# EAGLE design chipchestra-v05 (EAGLE 8.0.1)
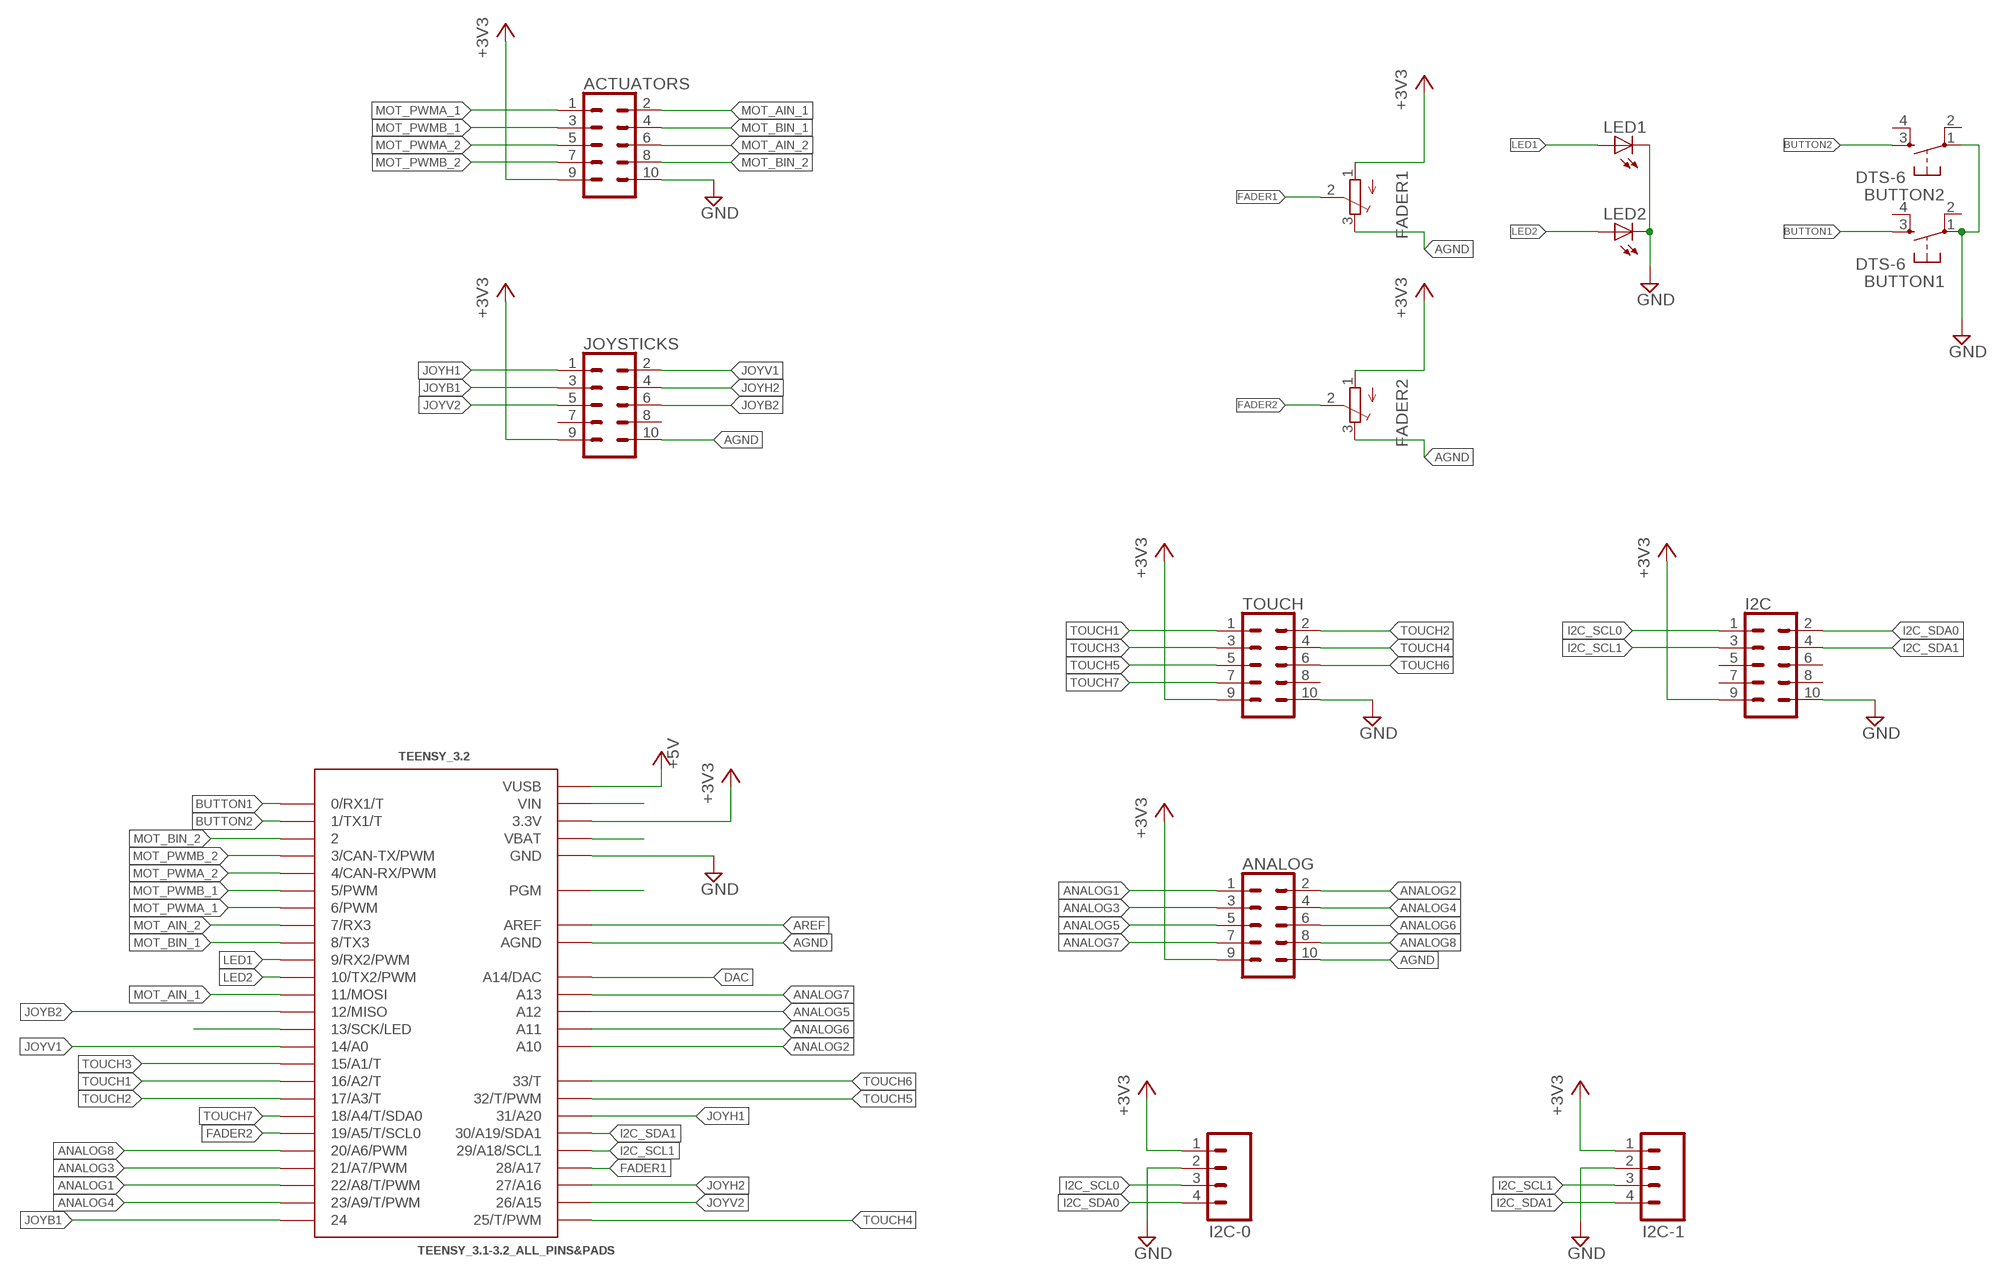
[diagram p0: schematic, sheet 1]

## Parts
ACTUATORS  CONN_05X2SHD_LOCK  [2X5-SHROUDED_LOCK]
ANALOG  CONN_05X2SHD_LOCK  [2X5-SHROUDED_LOCK]
BUTTON1  DTS-6  [DTS-6]
BUTTON2  DTS-6  [DTS-6]
FADER1  TRIMPOT3386  [TRIM-3386]
FADER2  TRIMPOT3386  [TRIM-3386]
I2C  CONN_05X2SHD_LOCK  [2X5-SHROUDED_LOCK]
I2C-0  M04LOCK  [1X04_LOCK]
I2C-1  M04LOCK  [1X04_LOCK]
JOYSTICKS  CONN_05X2SHD_LOCK  [2X5-SHROUDED_LOCK]
LED1  LED3MM  [LED3MM]
LED2  LED3MM  [LED3MM]
TEENSY_3.2  TEENSY_3.1-3.2_ALL_PINS&PADS  [TEENSY_3.0-3.2_ALL_PINS_&_PADS]
TOUCH  CONN_05X2SHD_LOCK  [2X5-SHROUDED_LOCK]

## Nets
+3V3: ACTUATORS.9 ANALOG.9 FADER1.1(A) FADER2.1(A) I2C-0.1 I2C-1.1 I2C.9 JOYSTICKS.9 TEENSY_3.2.3.3V TEENSY_3.2.3.3V1(3.3V) TEENSY_3.2.3.3V2(3.3V) TOUCH.9
+5V: TEENSY_3.2.VUSB
AGND: ANALOG.10 FADER1.3(E) FADER2.3(E) JOYSTICKS.10 TEENSY_3.2.AGND
ANALOG1: ANALOG.1 TEENSY_3.2.22/A8(22/A8/T/PWM)
ANALOG2: ANALOG.2 TEENSY_3.2.A10
ANALOG3: ANALOG.3 TEENSY_3.2.21/A7(21/A7/PWM)
ANALOG4: ANALOG.4 TEENSY_3.2.23/A9(23/A9/T/PWM)
ANALOG5: ANALOG.5 TEENSY_3.2.A12
ANALOG6: ANALOG.6 TEENSY_3.2.A11
ANALOG7: ANALOG.7 TEENSY_3.2.A13
ANALOG8: ANALOG.8 TEENSY_3.2.20/A6(20/A6/PWM)
AREF: TEENSY_3.2.AREF
BUTTON1: BUTTON1.3 TEENSY_3.2.0(0/RX1/T)
BUTTON2: BUTTON2.3 TEENSY_3.2.1(1/TX1/T)
DAC: TEENSY_3.2.RESET/DAC(A14/DAC)
FADER1: FADER1.2(S) TEENSY_3.2.28(28/A17)
FADER2: FADER2.2(S) TEENSY_3.2.19/A5(19/A5/T/SCL0)
GND: ACTUATORS.10 BUTTON1.1 BUTTON2.1 I2C-0.2 I2C-1.2 I2C.10 LED1.K(C) LED2.K(C) TEENSY_3.2.GND TEENSY_3.2.GND1(GND) TEENSY_3.2.GND2(GND) TOUCH.10
I2C_SCL0: I2C-0.3 I2C.1
I2C_SCL1: I2C-1.3 I2C.3 TEENSY_3.2.29(29/A18/SCL1)
I2C_SDA0: I2C-0.4 I2C.2
I2C_SDA1: I2C-1.4 I2C.4 TEENSY_3.2.30(30/A19/SDA1)
JOYB1: JOYSTICKS.3 TEENSY_3.2.24
JOYB2: JOYSTICKS.6 TEENSY_3.2.12(12/MISO)
JOYH1: JOYSTICKS.1 TEENSY_3.2.31(31/A20)
JOYH2: JOYSTICKS.4 TEENSY_3.2.27(27/A16)
JOYV1: JOYSTICKS.2 TEENSY_3.2.14/A0
JOYV2: JOYSTICKS.5 TEENSY_3.2.26(26/A15)
LED1: LED1.A TEENSY_3.2.9(9/RX2/PWM)
LED2: LED2.A TEENSY_3.2.10(10/TX2/PWM)
MOT_AIN_1: ACTUATORS.2 TEENSY_3.2.11(11/MOSI)
MOT_AIN_2: ACTUATORS.6 TEENSY_3.2.7(7/RX3)
MOT_BIN_1: ACTUATORS.4 TEENSY_3.2.8(8/TX3)
MOT_BIN_2: ACTUATORS.8 TEENSY_3.2.2
MOT_PWMA_1: ACTUATORS.1 TEENSY_3.2.6(6/PWM)
MOT_PWMA_2: ACTUATORS.5 TEENSY_3.2.4(4/CAN-RX/PWM)
MOT_PWMB_1: ACTUATORS.3 TEENSY_3.2.5(5/PWM)
MOT_PWMB_2: ACTUATORS.7 TEENSY_3.2.3(3/CAN-TX/PWM)
N$1: TEENSY_3.2.13(13/SCK/LED)
N$10: TEENSY_3.2.VBAT
N$48: TEENSY_3.2.VIN
N$53: TEENSY_3.2.PGM
TOUCH1: TEENSY_3.2.16/A2(16/A2/T) TOUCH.1
TOUCH2: TEENSY_3.2.17/A3(17/A3/T) TOUCH.2
TOUCH3: TEENSY_3.2.15/A1(15/A1/T) TOUCH.3
TOUCH4: TEENSY_3.2.25(25/T/PWM) TOUCH.4
TOUCH5: TEENSY_3.2.32(32/T/PWM) TOUCH.5
TOUCH6: TEENSY_3.2.33(33/T) TOUCH.6
TOUCH7: TEENSY_3.2.18/A4(18/A4/T/SDA0) TOUCH.7
Unconnected: BUTTON1.2 BUTTON1.4 BUTTON2.2 BUTTON2.4 I2C.5 I2C.6 I2C.7 I2C.8 JOYSTICKS.7 JOYSTICKS.8 TOUCH.8

## Library data of the parts
ACTUATORS ANALOG I2C JOYSTICKS TOUCH = SparkFun-Connectors:CONN_05X2: Multi connection point. Often used as Generic Header-pin footprint for 0.1 inch spaced/style header connections For AVR SPI programming port, see special device with nice symbol: "AVR_SPI_PROG_5x2.dev" You can populate with any combo of single row headers, but if you'd like an exact match, check these: 2x5 AVR ICSP Male Header <https://www.sparkfun.com/products/778> (PRT-00778) 2x5 Pin Shrouded Header <https://www.sparkfun.com/products/8506> (PRT-08506) On any of the 0.1 inch spaced packages, you can populate with these: Break Away Headers - Straight <https://www.sparkfun.com/products/116> (PRT-00116) Break Away Male Headers - Right Angle <https://www.sparkfun.com/products/553> (PRT-00553) Female Headers <https://www.sparkfun.com/products/115> (PRT-00115) Break Away Headers - Machine Pin <https://www.sparkfun.com/products/117> (PRT-00117) Break Away Female Headers - Swiss Machine Pin <https://www.sparkfun.com/products/743> (PRT-00743) Special note: the shrouded connector mates well with our 5x2 ribbon cables: 2x5 Pin IDC Ribbon Cable <https://www.sparkfun.com/products/8535> (PRT-08535); PROD_ID: CONN-08671; SF_ID: PRT-08506
BUTTON1 BUTTON2 = switch-tact:DTS-6
FADER1 FADER2 = adafruit:TRIMPOT: SMT trimmer potentiometer part number TC33X http://www.ladyada.net/library/eagle
I2C-0 I2C-1 = CMU-ArtFab:M04: Header 4 Standard 4-pin 0.1" header. Use with straight break away headers (SKU : PRT-00116), right angle break away headers (PRT-00553), swiss pins (PRT-00743), machine pins (PRT-00117), and female headers (PRT-00115). Molex polarized connector foot print use with SKU : PRT-08231 with associated crimp pins and housings. 1MM SMD Version SKU: PRT-10208
LED1 LED2 = adafruit:LED: LED OSRAM: - CHIPLED LG R971, LG N971, LY N971, LG Q971, LY Q971, LO R971, LY R971 LH N974, LH R974 LS Q976, LO Q976, LY Q976 LO Q996 - Hyper CHIPLED LW Q18S LB Q993, LB Q99A, LB R99A - SideLED LS A670, LO A670, LY A670, LG A670, LP A670 LB A673, LV A673, LT A673, LW A673 LH A674 LY A675 LS A676, LA A676, LO A676, LY A676, LW A676 LS A679, LY A679, LG A679 - Hyper Micro SIDELED® LS Y876, LA Y876, LO Y876, LY Y876 LT Y87S - SmartLED LW L88C, LW L88S LB L89C, LB L89S, LG L890 LS L89K, LO L89K, LY L89K LS L896, LA L896, LO L896, LY L896 - TOPLED LS T670, LO T670, LY T670, LG T670, LP T670 LSG T670, LSP T670, LSY T670, LOP T670, LYG T670 LG T671, LOG T671, LSG T671 LB T673, LV T673, LT T673, LW T673 LH T674 LS T676, LA T676, LO T676, LY T676, LB T676, LH T676, LSB T676, LW T676 LB T67C, LV T67C, LT T67C, LS T67K, LO T67K, LY T67K, LW E67C LS E67B, LA E67B, LO E67B, LY E67B, LB E67C, LV E67C, LT E67C LW T67C LS T679, LY T679, LG T679 LS T770, LO T770, LY T770, LG T770, LP T770 LB T773, LV T773, LT T773, LW T773 LH T774 LS E675, LA E675, LY E675, LS T675 LS T776, LA T776, LO T776, LY T776, LB T776 LHGB T686 LT T68C, LB T68C - Hyper Mini TOPLED® LB M676 - Mini TOPLED Santana® LG M470 LS M47K, LO M47K, LY M47K Source: http://www.osram.convergy.de/
TEENSY_3.2 = Teensy_3_and_LC_Series_Boards_v1.4:TEENSY_3.1-3.2_ALL_PINS&PADS: Footprint for Teensy 3.1 or 3.2 board using all pads and all through-holes. Pads need a 2x7 0.1" SMD header.

## Net classes
0 default: width 0.203 mm, clearance 0.152 mm
1 GND: width 0.203 mm, clearance 0.152 mm
2 Power: width 0.508 mm, clearance 0.152 mm

## Board
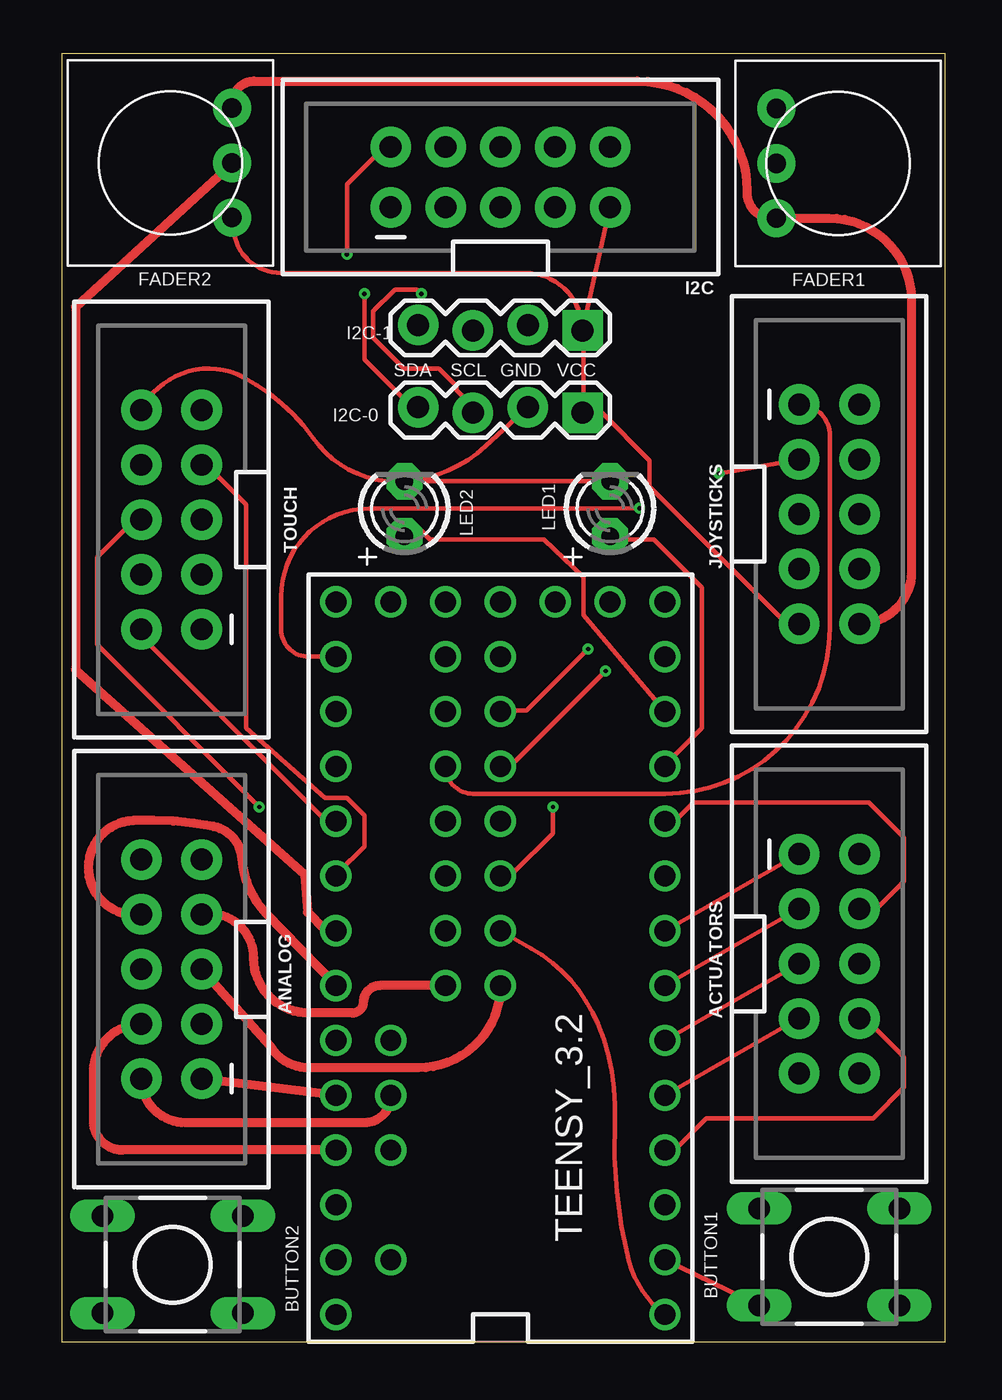
[diagram p1: board, top side]
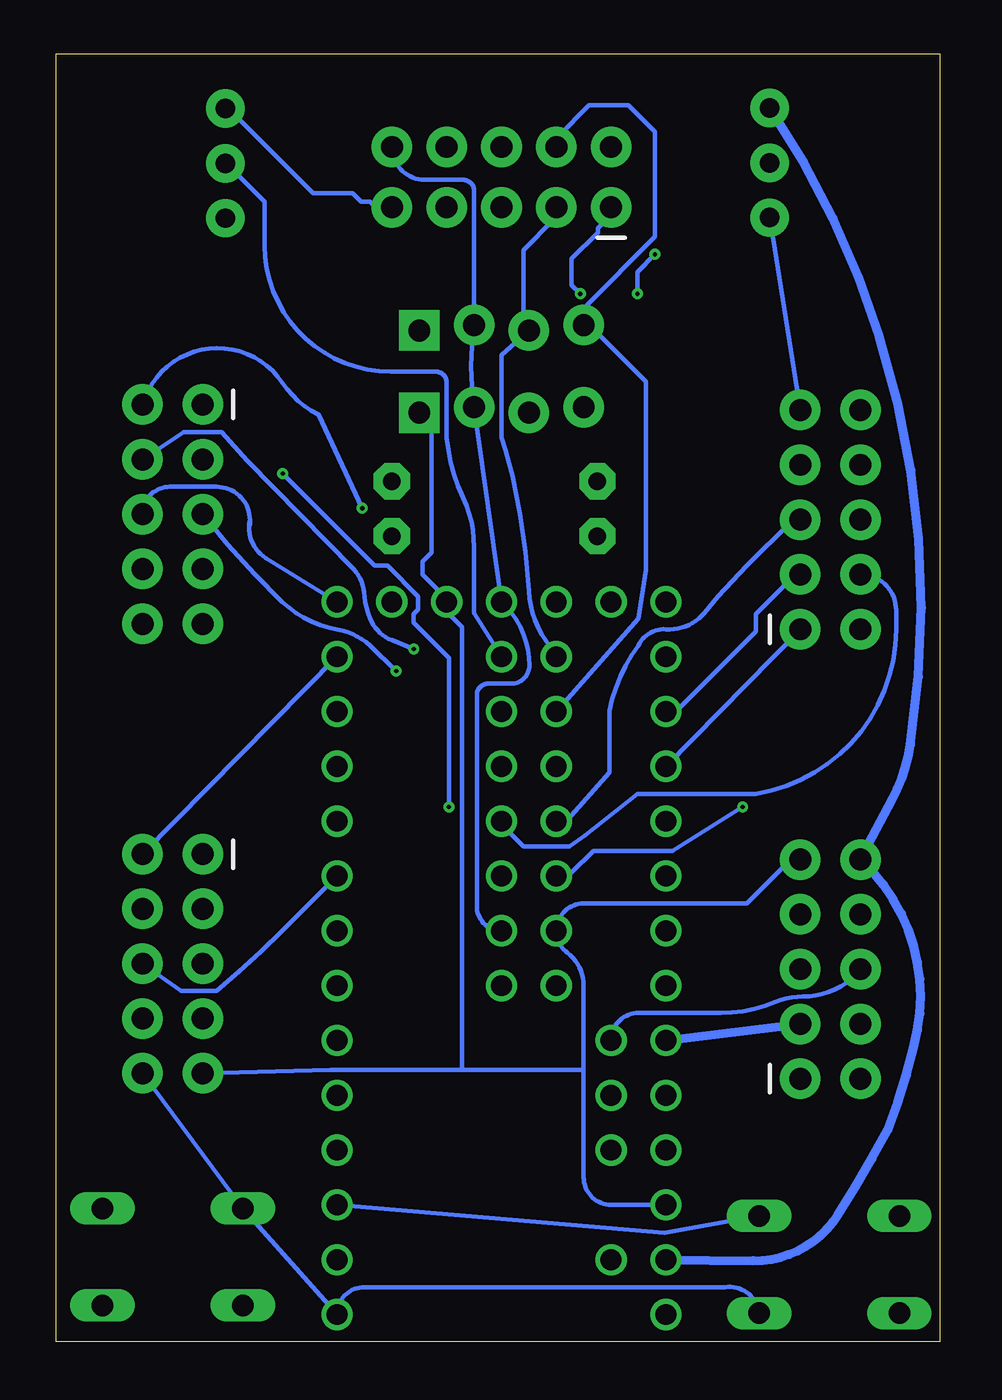
[diagram p2: board, bottom side, seen from below]

Size 40.95 x 59.68 mm. Coordinates in mm from the lower left corner, seen from the top.
Outline: 0,0 40.95,0 40.95,59.68 0,59.68 0,0
Copper layers (1*16): Top 0.035mm / dielectric 1.5mm / Bottom 0.035mm
Design rules "default *": minimum track width 8mil, minimum drill 8mil, track to track 8mil, track to pad 8mil, pad to pad 8mil, via to via 8mil, smd to smd 8mil, copper to edge 8mil, drill to drill 6mil, minimum pad ring 6mil, minimum via ring 6mil, stop-mask expansion 4mil, vias tented up to drill 0mil, thermal gap 10mil

### Footprints (pad centres in the part's own frame; a part is rotated, then mirrored left to right if it is on the bottom)
2X5-SHROUDED_LOCK = drill 1.016 pad 1.88: 1 -1.397,5.08; 2 1.397,5.08; 3 -1.397,2.54; 4 1.397,2.54; 5 -1.397,0; 6 1.397,0; 7 -1.397,-2.54; 8 1.397,-2.54; 9 -1.397,-5.08; 10 1.397,-5.08
DTS-6 = drill 1 long: 1 -3.25,2.25; 2 3.25,2.25; 3 -3.25,-2.25; 4 3.25,-2.25
TRIM-3386 = drill 0.9 pad 1.778: 1 -2.54,-2.857; 2 0,-2.857; 3 2.54,-2.857
1X04_LOCK = drill 1.016 pad 1.88 square: 1 0,0.127 | drill 1.016 pad 1.88: 2 2.54,-0.127; 3 5.08,0.127; 4 7.62,-0.127
LED3MM = drill 0.813 pad 1.676 octagon: A -1.27,0; K 1.27,0
TEENSY_3.0-3.2_ALL_PINS_&_PADS = drill 0.965: 0 -7.62,13.97; 1 -7.62,11.43; 2 -7.62,8.89; 3 -7.62,6.35; 3.3V 7.62,11.43; 3.3V1 -2.54,-16.51; 3.3V2 2.54,-1.27; 4 -7.62,3.81; 5 -7.62,1.27; 6 -7.62,-1.27; 7 -7.62,-3.81; 8 -7.62,-6.35; 9 -7.62,-8.89; 10 -7.62,-11.43; 11 -7.62,-13.97; 12 -7.62,-16.51; 13 7.62,-16.51; 14/A0 7.62,-13.97; 15/A1 7.62,-11.43; 16/A2 7.62,-8.89; 17/A3 7.62,-6.35; 18/A4 7.62,-3.81; 19/A5 7.62,-1.27; 20/A6 7.62,1.27; 21/A7 7.62,3.81; 22/A8 7.62,6.35; 23/A9 7.62,8.89; 24 0,-3.81; 25 0,-6.35; 26 0,-8.89; 27 0,-11.43; 28 0,-13.97; 29 2.54,-13.97; 30 2.54,-11.43; 31 2.54,-8.89; 32 2.54,-6.35; 33 2.54,-3.81; A10 5.08,6.35; A11 5.08,3.81; A12 0,1.27; A13 2.54,1.27; AGND 7.62,13.97; AREF 5.08,8.89; GND -7.62,16.51; GND1 0,-16.51; GND2 0,-1.27; PGM 2.54,-16.51; RESET/DAC 5.08,-16.51; VBAT -5.08,-16.51; VIN 7.62,16.51; VUSB 5.08,13.97

### Placement (x,y rotation side)
ACTUATORS  35.56,17.53 0 top
ANALOG  5.08,17.27 180 top
BUTTON1  35.56,3.94 0 top
BUTTON2  5.13,3.58 180 top
FADER1  35.97,54.61 270 top
FADER2  5.03,54.64 90 top
I2C  20.32,53.98 90 top
I2C-0  24.13,43.18 180 top
I2C-1  24.13,46.99 180 top
JOYSTICKS  35.56,38.35 0 top
LED1  25.4,38.61 90 top
LED2  15.88,38.61 90 top
TEENSY_3.2  20.32,17.78 180 top
TOUCH  5.08,38.1 180 top

### Tracks (layer width: path | path; a pad name or v marks a point on that pad's centre or on a via)
+3V3
  Top 0.203: 24.18,43.08 24.99,43.08 27.23,40.84 27.23,39.62 33.53,33.33 34.14,33.33 JOYSTICKS.9 | 24.18,43.08 24.18,46.74 I2C-1.1 | 24.18,43.08 I2C-0.1 | I2C-1.1 I2C.9 | FADER2.1 7.94,51.75 arc90 10.16,49.53 21.46,49.53 arc-90 I2C-1.1
  Bottom 0.203: ANALOG.9 6.91,22.35 8.94,20.32 16.51,20.32 arc-90 TEENSY_3.2.3.3V2 arc-53 17.27,18.03 arc53 16.51,16.51 16.51,12.6 | 34.14,12.39 ACTUATORS.9 28.25,12.6 22.15,12.6 | FADER1.1 33.33,57.1 32.92,57.1 29.06,53.24 27.23,53.24 26.82,52.83 26.42,52.83 26.21,52.63 25.4,52.63 I2C.9 | I2C-0.1 23.98,42.88 23.57,42.47 23.57,36.58 23.98,36.17 23.98,35.56 22.96,34.54 22.96,34.34 TEENSY_3.2.3.3V1 22.76,34.14 22.76,33.73 22.15,33.12 22.15,12.6 | TEENSY_3.2.3.3V 15.24,6.35 arc90 16.51,7.62 16.51,12.6 | 22.15,12.6 16.51,12.6 | TOUCH.9 FADER2.1
AGND
  Top 0.406: FADER2.3 7.94,57.47 arc-90 8.89,58.42 26.67,58.42 arc-90 31.75,53.34 arc103 FADER1.3 35.56,52.07 arc-90 39.37,48.26 39.37,35.69 arc-90 JOYSTICKS.10
  Bottom 0.203: 3.66,22.35 ANALOG.10
  Bottom 0.406: TEENSY_3.2.AGND 8.66,3.76 arc-58 4.72,5.89 arc-4 2.41,9.83 arc-8 1.22,13.66 arc-63 ANALOG.10 2.21,25.15 arc-19 1.37,27.66 arc-27 2.82,46.58 arc-17 FADER2.3
ANALOG1
  Top 0.406: TEENSY_3.2.22/A8 ANALOG.1
ANALOG2
  Top 0.406: TEENSY_3.2.A10 15.24,11.38 arc-90 14.02,10.16 5.71,10.16 arc-90 ANALOG.2
ANALOG3
  Bottom 0.406: TEENSY_3.2.21/A7 ANALOG.3
ANALOG4
  Top 0.406: TEENSY_3.2.23/A9 2.79,8.89 arc-90 1.47,10.21 1.47,12.52 arc-90 ANALOG.4
ANALOG5
  Top 0.406: TEENSY_3.2.A12 arc-90 16.51,12.7 11.43,12.7 arc-59 9.65,13.72 ANALOG.5
ANALOG6
  Bottom 0.203: TEENSY_3.2.A11 arc90 13.97,15.24 10.16,15.24 arc-23 7.62,15.75 arc23 6.35,16 arc-51 ANALOG.6
ANALOG7
  Top 0.406: TEENSY_3.2.A13 14.73,16.51 arc90 13.97,15.75 arc-90 13.46,15.24 11.43,15.24 arc-90 8.89,17.78 arc100 ANALOG.7
ANALOG8
  Top 0.406: TEENSY_3.2.20/A6 9.47,19.86 arc-40 8.36,22.38 arc75 7.04,23.88 arc14 3.3,24.16 arc185 ANALOG.8
BUTTON1
  Top 0.203: TEENSY_3.2.0 BUTTON1.3
BUTTON2
  Bottom 0.203: BUTTON2.3 12.78,5.05 TEENSY_3.2.1
FADER1
  Bottom 0.203: FADER1.2 33.33,54.46 32.92,54.46 31.29,52.83 31.29,50.8 arc-90 25.45,44.96 23.37,44.96 arc90 22.86,44.45 22.86,41.91 arc-20 22.1,39.12 arc25 21.59,36.83 21.59,33.78 TEENSY_3.2.28
FADER2
  Top 0.203: 12.19,19.1 12.6,19.1 TEENSY_3.2.19/A5 | 7.52,54.25 7.92,54.25 FADER2.2
  Top 0.406: 12.19,19.1 11.38,19.91 11.25,21.67 0.64,31.14 0.64,47.95 7.52,54.25
GND
  Top 0.203: I2C-0.2 19.63,41.5 arc-39 LED2.K | LED2.K arc-59 11.63,41.88 arc27 8.41,44.7 arc91 TOUCH.10 | LED1.K LED2.K | TEENSY_3.2.GND2 21.74,18.24 arc-38 24.84,14.73 arc-26 25.63,10.21 arc18 26.29,3.73 arc38 TEENSY_3.2.GND
  Bottom 0.203: BUTTON2.1 arc-90 9.95,2.54 26.67,2.54 arc-90 TEENSY_3.2.GND BUTTON1.1 ACTUATORS.10 | I2C.10 arc-90 23.88,53.85 22.1,53.85 arc90 21.59,53.34 I2C-1.2 arc-16 I2C-0.2 TEENSY_3.2.GND1 arc47 19.02,31.34 arc90 19.86,30.5 20.93,30.5 arc-90 21.46,29.97 21.46,20.19 arc-90 TEENSY_3.2.GND2
I2C_SCL0  (via drill 0.2)
  Top 0.203: v16.66,48.56 16.46,48.77 15.44,48.77 14.43,47.75 14.43,46.53 15.85,45.11 17.48,45.11 18.29,44.3 18.29,44.09 18.9,43.48 18.9,43.08 I2C-0.3
  Bottom 0.203: v16.66,48.56 17.07,48.97 17.07,50.19 15.85,51.41 15.85,51.61 15.24,52.22 I2C.1
I2C_SCL1
  Bottom 0.203: I2C.3 17.88,52.43 17.88,52.02 19.3,50.6 19.3,47.14 19.1,46.94 I2C-1.3 20.32,45.72 20.32,41.91 arc6 19.81,40.13 arc10 19.05,34.8 arc-31 18.29,32.51 TEENSY_3.2.29
I2C_SDA0  (via drill 0.2)
  Top 0.203: v14.02,48.56 14.02,45.52 16.05,43.48 16.46,43.48 I2C-0.4 | v13.21,50.39 13.21,53.65 14.83,55.27 15.24,55.27 I2C.2
  Bottom 0.203: v14.02,48.56 14.02,49.58 v13.21,50.39
I2C_SDA1
  Bottom 0.203: I2C.4 17.68,55.47 17.68,55.88 16.26,57.3 14.43,57.3 13.21,56.08 13.21,51.21 16.46,47.95 16.46,47.14 I2C-1.4 16.46,46.94 16.05,46.94 13.61,44.5 13.61,35.76 13.97,33.53 TEENSY_3.2.30
JOYB1  (via drill 0.2)
  Top 0.203: v22.76,24.79 22.76,23.57 20.93,21.74 20.32,21.74 TEENSY_3.2.24 | v30.45,40.23 JOYSTICKS.3
  Bottom 0.203: v22.76,24.79 22.76,31.7 24.38,33.33 24.38,33.73 24.18,33.93 24.18,34.54 25.6,35.97 26.21,35.97 v30.45,40.23
JOYB2
  Bottom 0.203: 31.98,38.08 31.98,37.87 | 31.98,38.08 arc-90 33.53,39.62 35.69,39.62 arc-90 JOYSTICKS.6 | TEENSY_3.2.12 31.24,36.32 arc71 31.98,38.08
JOYH1
  Top 0.203: TEENSY_3.2.31 arc90 19.05,25.4 27.94,25.4 arc90 35.59,33.05 35.59,42.01 arc90 JOYSTICKS.1
JOYH2  (via drill 0.2)
  Top 0.203: v24.38,32.11 21.54,29.26 20.32,29.26 TEENSY_3.2.27
  Bottom 0.203: v24.38,32.11 25.4,32.51 arc46 26.42,33.53 arc16 26.67,34.54 arc-41 27.18,35.81 32.11,40.84 33.3,42.16 35.05,42.16 JOYSTICKS.4
JOYV1  (via drill 0.2)
  Top 0.203: TEENSY_3.2.14/A0 11.43,31.75 arc-90 10.16,33.02 10.16,34.54 arc-90 14.22,38.61 24.61,38.61 v26.77,38.63
  Bottom 0.203: v26.77,38.63 28.8,42.98 arc29 30.48,44.45 arc-130 JOYSTICKS.2
JOYV2  (via drill 0.2)
  Top 0.203: v25.2,31.09 20.93,26.82 20.32,26.82 TEENSY_3.2.26
  Bottom 0.203: 34.14,38.2 JOYSTICKS.5 arc-8 30.48,34.29 arc-34 27.94,33.02 arc34 26.42,32.26 v25.2,31.09
LED1
  Top 0.203: TEENSY_3.2.9 28.04,26.82 29.67,28.45 29.67,34.95 27.43,37.19 25.4,37.19 LED1.A
LED2
  Top 0.203: LED2.A 16.05,37.39 16.26,37.59 16.66,37.59 17.07,37.19 22.35,37.19 24.18,35.43 24.18,33.68 TEENSY_3.2.10
MOT_AIN_1
  Bottom 0.203: ACTUATORS.2 TEENSY_3.2.11
MOT_AIN_2
  Bottom 0.203: ACTUATORS.6 35.15,16.26 33.53,16.26 arc-5 30.48,19.05 TEENSY_3.2.7
MOT_BIN_1
  Top 0.203: TEENSY_3.2.8 28.04,24.18 28.45,24.18 29.26,24.99 37.39,24.99 39.01,23.37 39.01,21.34 37.8,20.12 36.98,20.12 ACTUATORS.4
MOT_BIN_2
  Top 0.203: TEENSY_3.2.2 28.04,8.94 28.45,8.94 29.87,10.36 37.59,10.36 39.01,11.79 39.01,13.21 37.39,14.83 36.98,14.83 ACTUATORS.8
MOT_PWMA_1
  Top 0.203: TEENSY_3.2.6 ACTUATORS.1
MOT_PWMA_2
  Top 0.203: TEENSY_3.2.4 ACTUATORS.5
MOT_PWMB_1
  Top 0.203: TEENSY_3.2.5 ACTUATORS.3
MOT_PWMB_2
  Top 0.203: TEENSY_3.2.3 ACTUATORS.7
TOUCH1
  Bottom 0.203: TEENSY_3.2.16/A2 TOUCH.1
TOUCH2
  Top 0.203: TEENSY_3.2.17/A3 12.6,24.18 12.19,24.18 3.86,32.51 3.86,32.92 TOUCH.2
TOUCH3
  Bottom 0.203: TOUCH.3 6.71,35.56 8.53,33.73 8.53,32.92 12.19,29.26 12.6,29.26 TEENSY_3.2.15/A1
TOUCH4
  Bottom 0.203: TEENSY_3.2.25 20.32,23.98 19.3,22.96 17.17,22.96 16.46,23.47 14.02,25.4 8.53,25.4 arc-81 2.03,33.02 2.03,33.91 arc-90 TOUCH.4
TOUCH5
  Bottom 0.203: TEENSY_3.2.32 17.68,24.18 17.27,24.18 15.32,26.39 15.32,29.23 arc26 13.97,32.26 arc70 12.7,33.02 arc-55 10.92,33.78 arc6 8.94,35.97 6.91,38 6.5,38 TOUCH.5
TOUCH6  (via drill 0.2)
  Top 0.203: v9.14,24.79 1.63,32.31 1.63,36.37 3.25,38 3.66,38 TOUCH.6
  Bottom 0.203: 13.82,22.76 13.97,22.76 | 13.97,22.76 16.05,22.76 17.07,21.74 17.68,21.74 TEENSY_3.2.33 | 13.97,22.76 12.39,22.76 v9.14,24.79
TOUCH7
  Top 0.203: TOUCH.7 6.71,40.64 8.53,38.81 8.53,28.45 12.19,25.2 13.21,25.2 14.02,24.38 14.02,22.96 12.8,21.74 TEENSY_3.2.18/A4